# Altium schematic sheet Battery_Power.SchDoc
size B; Organization: Mechanart, LLC; Address1: 397 Laurie Meadows Drive; Address2: Apt. 437; Address3: San Mateo, CA 94403
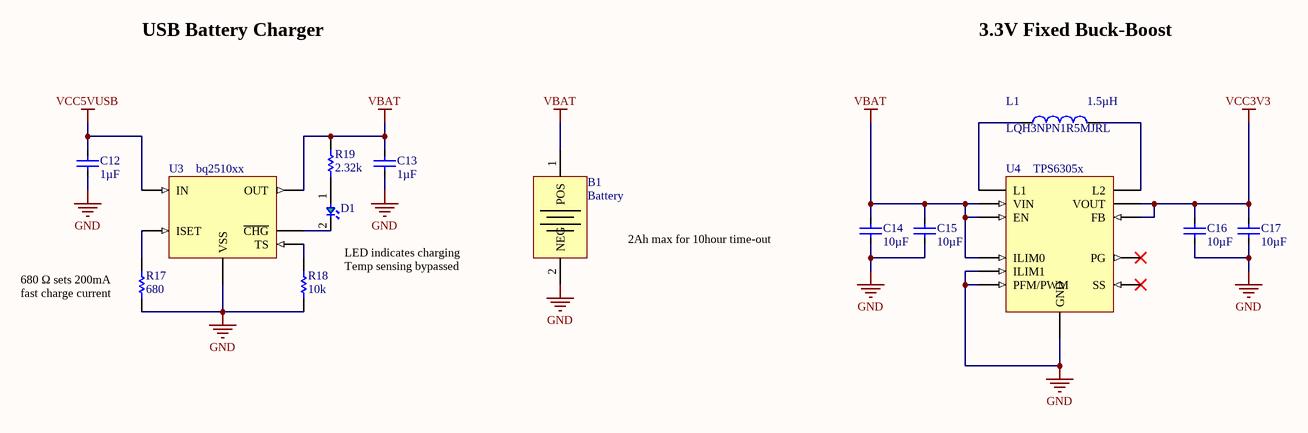
[diagram p0: Battery_Power.SchDoc]

## Parts
B1  Battery  [S2B-PH-SM4]
C12  1µF  [CAPC1005X50L25N]
C13  1µF  [CAPC1005X50L25N]
C14  10µF  [CAPC1220X95L30L]
C15  10µF  [CAPC1220X95L30L]
C16  10µF  [CAPC1220X95L30L]
C17  10µF  [CAPC1220X95L30L]
D1  Green LED  [SML-P11Mxxx]  (value not drawn)
L1  1.5µH  Manufacturer Part Number: LQH3NPN1R5MJRL  [INDC3030X30L90L]
R17  680  [RESC1005X40L25N]
R18  10k  [RESC1005X40L25N]
R19  2.32k  [RESC1005X40L25N]
U3  bq2510xx  [BGA6C40P3X2_157X88X50B23L]
U4  TPS6305x  [BGA12C40P4X3_168X128X62B25L]

## Nets
GND: B1.2(NEG) C12.2 C13.2 C14.2 C15.2 C16.2 C17.2 R17.1 R18.1 U3.C2(VSS) U4.B1(GND) U4.B3(ILIM1) U4.C2(PFM/PWM)
VBAT: B1.1(POS) C13.1 C14.1 C15.1 R19.2 U3.A1(OUT) U4.A2(VIN) U4.A3(EN) U4.B2(ILIM0)
VCC3V3: C16.1 C17.1 U4.D1(VOUT) U4.D2(FB)
VCC5VUSB: C12.1 U3.A2(IN)
NetD1_1: D1.1(A) R19.1
NetD1_2: D1.2(C) U3.C1(~{CHG})
NetL1_1: L1.1 U4.A1(L1)
NetL1_2: L1.2 U4.C1(L2)
NetR17_2: R17.2 U3.B2(ISET)
NetR18_2: R18.2 U3.B1(TS)

Not connected (* = marked no-connect by the designer): U4 C3(PG)* D3(SS)*

## Notes on the sheet
- USB Battery Charger
- 3.3V Fixed Buck-Boost
- (near R17) 680 Ω sets 200mA fast charge current
- LED indicates charging
  Temp sensing bypassed
- 2Ah max for 10hour time-out
- Title
- Size:
- Date:
- B
- Number:
- Time:
- Revision:
- Sheet
- of
- File:

## Library data of the parts
B1 = S2B-PH-SM4-TB(LF)(SN): CONN HEADER PH SIDE 2POS 2MM SMD; Manufacturer: JST Sales America Inc.; Connector Type: Header, Shrouded; Number of Positions: 2; Number of Positions Loaded: All; Pitch: 0.079" (2.00mm); Design Item Id: S2B-PH-SM4-TB(LF)(SN); Supplier 1: Digi-Key; Supplier Part Number 1: 455-1749-1-ND; Manufacturer Part Number: S2B-PH-SM4-TB(LF)(SN); RoHS: RoHS Compliant; Category: Connectors, Interconnects; Stock 1: 161962; Pricing 1: 1=0.56, 10=0.521, 25=0.4688, 50=0.4168, 100=0.3994, 250=0.36472, 500=0.34734 (USD); Packaging: Cut Tape (CT); Mounting Type: Surface Mount, Right Angle; ComponentLink1URL: http://www.jst-mfg.com/product/pdf/eng/ePH.pdf; ComponentLink1Description: http://www.jst-mfg.com/product/pdf/eng/ePH.pdf; Contact Type: Male Pin; Number of Rows: 1; Row Spacing: -; Contact Mating Length: 0.130" (3.30mm); Termination: Solder; Fastening Type: Detent Lock; Features: Solder Retention; Contact Finish: Tin; Contact Finish Thickness: -; Color: Natural
C12 C13 = GRM155R70J105KA12D: CAP CER 1UF 6.3V X7R 0402; Manufacturer: Murata Electronics North America; Tolerance: ±10%; Design Item Id: GRM155R70J105KA12D; Supplier 1: Digi-Key; Supplier Part Number 1: 490-10024-1-ND; Manufacturer Part Number: GRM155R70J105KA12D; RoHS: RoHS Compliant; Category: Capacitors; Stock 1: 26230; Pricing 1: 1=0.1, 10=0.076, 50=0.041, 100=0.0347, 250=0.02836, 500=0.02426, 1000=0.0189, 5000=0.01575 (USD); Packaging: Cut Tape (CT); Applications: General Purpose; Operating Temperature: -55°C ~ 125°C; Mounting Type: Surface Mount, MLCC; Package / Case: 0402 (1005 Metric); ComponentLink1URL: http://www.murata.com/~/media/webrenewal/support/library/catalog/products/capacitor/mlcc/c02e.ashx; ComponentLink1Description: http://www.murata.com/~/media/webrenewal/support/library/catalog/products/capacitor/mlcc/c02e.ashx; Capacitance: 1µF; Voltage - Rated: 6.3V; Temperature Coefficient: X7R; Ratings: -; Size / Dimension: 0.039" L x 0.020" W (1.00mm x 0.50mm); Height - Seated (Max): -; Thickness (Max): 0.022" (0.55mm); Lead Spacing: -; Features: Derating Recommended; Lead Style: -
C14-C17 = JWK212C6106MD-T: CAP CER 10UF 6.3V X6S 0508; Manufacturer: Taiyo Yuden; Tolerance: ±20%; Design Item Id: JWK212C6106MD-T; Supplier 1: Digi-Key; Supplier Part Number 1: 587-3114-1-ND; Manufacturer Part Number: JWK212C6106MD-T; RoHS: RoHS Compliant; Category: Capacitors; Stock 1: 18381; Pricing 1: 1=0.58, 10=0.457, 50=0.3306, 100=0.2755, 250=0.20664, 500=0.17632, 1000=0.13775 (USD); Packaging: Cut Tape (CT); Applications: Bypass, Decoupling; Operating Temperature: -55°C ~ 105°C; Mounting Type: Surface Mount, MLCC; Package / Case: 0508 (1220 Metric); ComponentLink1URL: http://media.digikey.com/pdf/Data%20Sheets/Taiyo%20Yuden%20PDFs%20URL%20links/JWK,%20AWK.pdf; ComponentLink1Description: http://media.digikey.com/pdf/Data%20Sheets/Taiyo%20Yuden%20PDFs%20URL%20links/JWK,%20AWK.pdf; Capacitance: 10µF; Voltage - Rated: 6.3V; Temperature Coefficient: X6S; Ratings: -; Size / Dimension: 0.049" L x 0.079" W (1.25mm x 2.00mm); Height - Seated (Max): -; Thickness (Max): 0.037" (0.95mm); Lead Spacing: -; Features: Low ESL (Reverse Geometry); Lead Style: -
D1 = SML-P11MTT86: LED GREEN CLEAR 0402 SMD; Manufacturer: Rohm Semiconductor; Lens Color: Colorless; Millicandela Rating: 2.1mcd; Lens Style/Size: Square with Flat Top, 0.60mm; Voltage - Forward (Vf) (Typ): 1.9V; Current - Test: 1mA; Wavelength - Dominant: 569nm; Design Item Id: SML-P11MTT86; Supplier 1: Digi-Key; Supplier Part Number 1: 511-1652-1-ND; RoHS: RoHS Compliant; Category: Optoelectronics; Stock 1: 349790; Pricing 1: 1=0.54, 10=0.4, 25=0.32, 100=0.212, 250=0.15, 500=0.128, 1000=0.1, 2500=0.088, 5000=0.076 (USD); Packaging: Cut Tape (CT); Mounting Type: Surface Mount; Package / Case: 0402 (1005 Metric); Supplier Device Package: *; ComponentLink1URL: http://rohmfs.rohm.com/en/products/databook/datasheet/opto/led/chip_mono/sml-p11_p-eco.pdf; ComponentLink1Description: http://rohmfs.rohm.com/en/products/databook/datasheet/opto/led/chip_mono/sml-p11_p-eco.pdf; Color: Green; Lens Transparency: Clear; Viewing Angle: -; Wavelength - Peak: -; Features: -; Size / Dimension: 1.00mm L x 0.60mm W; Height (Max): 0.25mm; Manufacturer Part Number: SML-P11MTT86
L1 = LQH3NPN1R5MJRL: FIXED IND 1.5UH 1.1A 49 MOHM SMD; Manufacturer: Murata Electronics North America; Type: Wirewound; Material - Core: Ferrite; Tolerance: ±20%; Current - Saturation: 1.95A; Shielding: Shielded; DC Resistance (DCR): 58.8 mOhm Max; Frequency - Self Resonant: 60MHz; Frequency - Test: 1MHz; Design Item Id: LQH3NPN1R5MJRL; Supplier 1: Digi-Key; Supplier Part Number 1: 490-9576-1-ND; RoHS: RoHS Compliant; Category: Inductors, Coils, Chokes; Stock 1: 1584; Pricing 1: 1=0.45, 10=0.409, 25=0.3632, 50=0.3178, 100=0.2951, 250=0.2724, 500=0.25878, 750=0.23608, 1000=0.20884 (USD); Packaging: Cut Tape (CT); Operating Temperature: -40°C ~ 105°C; Mounting Type: Surface Mount; Package / Case: 1212 (3030 Metric); Supplier Device Package: 1212 (3030 Metric); ComponentLink1URL: http://psearch.murata.com/inductor/product/LQH3NPNR68NJR#.pdf; ComponentLink1Description: http://psearch.murata.com/inductor/product/LQH3NPNR68NJR#.pdf; Inductance: 1.5µH; Current Rating: 1.1A; Q @ Freq: -; Size / Dimension: 0.118" L x 0.118" W (3.00mm x 3.00mm); Height - Seated (Max): 0.047" (1.20mm)
R17 = ERJ-2RKF6800X: RES SMD 680 OHM 1% 1/10W 0402; Manufacturer: Panasonic Electronic Components; Power (Watts): 0.1W, 1/10W; Temperature Coefficient: ±100ppm/°C; Design Item Id: ERJ-2RKF6800X; Resistance: 680; Footprint: RESC_1005[0402]_N; Supplier 1: Digi-Key; Supplier Part Number 1: P680LCT-ND; Manufacturer Part Number: ERJ-2RKF6800X; RoHS: RoHS Compliant; Category: Resistors; Stock 1: 260284; Pricing 1: 1=0.1, 50=0.015, 100=0.011, 250=0.0084, 500=0.00674, 1000=0.00496, 5000=0.00355 (USD); Packaging: Cut Tape (CT); Operating Temperature: -55°C ~ 155°C; Package / Case: 0402 (1005 Metric); Supplier Device Package: 0402; ComponentLink1URL: http://industrial.panasonic.com/www-cgi/jvcr13pz.cgi?E+PZ+3+AOA0002+ERJ2RKF6800X+7+WW; ComponentLink1Description: http://industrial.panasonic.com/www-cgi/jvcr13pz.cgi?E+PZ+3+AOA0002+ERJ2RKF6800X+7+WW; Tolerance: ±1%; Composition: Thick Film; Features: Automotive AEC-Q200; Size / Dimension: 0.039" L x 0.020" W (1.00mm x 0.50mm); Height: 0.016" (0.40mm); Number of Terminations: 2
R18 = CRCW040210K0JNED: RES SMD 10K OHM 5% 1/16W 0402; Manufacturer: Vishay Dale; Power (Watts): 0.063W, 1/16W; Temperature Coefficient: ±200ppm/°C; Design Item Id: CRCW040210K0JNED; Resistance: 10k; Footprint: RESC_1005[0402]_N; Supplier 1: Digi-Key; Supplier Part Number 1: 541-10KJCT-ND; Manufacturer Part Number: CRCW040210K0JNED; RoHS: RoHS Compliant; Category: Resistors; Stock 1: 446077; Pricing 1: 10=0.074, 50=0.04, 200=0.02295, 1000=0.01566 (USD); Packaging: Cut Tape (CT); Operating Temperature: -55°C ~ 155°C; Package / Case: 0402 (1005 Metric); Supplier Device Package: 0402 (1005 Metric); ComponentLink1URL: http://www.vishay.com/docs/20035/dcrcwe3.pdf; ComponentLink1Description: http://www.vishay.com/docs/20035/dcrcwe3.pdf; Tolerance: ±5%; Composition: Thick Film; Features: Automotive AEC-Q200; Size / Dimension: 0.039" L x 0.020" W (1.00mm x 0.50mm); Height: 0.016" (0.40mm); Number of Terminations: 2
R19 = ERJ-2RKF2321X: RES SMD 2.32K OHM 1% 1/10W 0402; Manufacturer: Panasonic Electronic Components; Power (Watts): 0.1W, 1/10W; Temperature Coefficient: ±100ppm/°C; Design Item Id: ERJ-2RKF2321X; Resistance: 2.32k; Footprint: RESC_1005[0402]_N; Supplier 1: Digi-Key; Supplier Part Number 1: P2.32KLCT-ND; Manufacturer Part Number: ERJ-2RKF2321X; RoHS: RoHS Compliant; Category: Resistors; Stock 1: 166119; Pricing 1: 1=0.1, 50=0.0124, 100=0.0091, 250=0.00692, 500=0.00554, 1000=0.00408, 5000=0.00293 (USD); Packaging: Cut Tape (CT); Operating Temperature: -55°C ~ 155°C; Package / Case: 0402 (1005 Metric); Supplier Device Package: 0402; ComponentLink1URL: http://industrial.panasonic.com/www-cgi/jvcr13pz.cgi?E+PZ+3+AOA0002+ERJ2RKF2321X+7+WW; ComponentLink1Description: http://industrial.panasonic.com/www-cgi/jvcr13pz.cgi?E+PZ+3+AOA0002+ERJ2RKF2321X+7+WW; Tolerance: ±1%; Composition: Thick Film; Features: Automotive AEC-Q200; Size / Dimension: 0.039" L x 0.020" W (1.00mm x 0.50mm); Height: 0.016" (0.40mm); Number of Terminations: 2
U3 = BQ25101YFPR: IC LI-ION CHARGE MGMT 6DSBGA; Manufacturer: Texas Instruments; Voltage - Supply: 3.5 V ~ 28 V; Function: Charge Management; Battery Chemistry: Li-Ion, Li-Pol; Design Item Id: BQ25101YFPR; Supplier 1: Digi-Key; Supplier Part Number 1: 296-39933-1-ND; Manufacturer Part Number: BQ25101YFPR; RoHS: RoHS Compliant; Category: Integrated Circuits (ICs); Stock 1: 614; Pricing 1: 1=2.05, 10=1.843, 100=1.4783, 500=1.215, 1000=0.84375 (USD); Packaging: Cut Tape (CT); Operating Temperature: 0°C ~ 125°C; Mounting Type: Surface Mount; Package / Case: 6-XFBGA, DSBGA; Supplier Device Package: 6-DSBGA; ComponentLink1URL: http://www.ti.com/lit/ds/symlink/bq25100h.pdf; ComponentLink1Description: http://www.ti.com/lit/ds/symlink/bq25100h.pdf
U4 = TPS63051YFFR: IC REG BCK BST 3.3V 0.5A 12DSBGA; Manufacturer: Texas Instruments; Output Type: Fixed; Number of Outputs: 1; Frequency - Switching: 2.5MHz; Current - Output: 500mA; Synchronous Rectifier: Yes; Function: Step-Up/Step-Down; Output Configuration: Positive; Topology: Buck-Boost; Voltage - Input (Min): 2.5V; Voltage - Input (Max): 5.5V; Design Item Id: TPS63051YFFR; Supplier 1: Digi-Key; Supplier Part Number 1: 296-40860-1-ND; Manufacturer Part Number: TPS63051YFFR; RoHS: RoHS Compliant; Category: Integrated Circuits (ICs); Stock 1: 2089; Pricing 1: 1=2.27, 10=2.039, 100=1.6359, 500=1.3446, 1000=0.93375 (USD); Packaging: Cut Tape (CT); Operating Temperature: -40°C ~ 85°C (TA); Mounting Type: Surface Mount; Package / Case: 12-UFBGA, DSBGA; Supplier Device Package: 12-DSBGA (1.6x1.2); ComponentLink1URL: http://www.ti.com/lit/ds/symlink/tps63050.pdf; ComponentLink1Description: http://www.ti.com/lit/ds/symlink/tps63050.pdf; Voltage - Output (Min/Fixed): 3.3V; Voltage - Output (Max): -